# Altium project AC_fan.PrjPcb
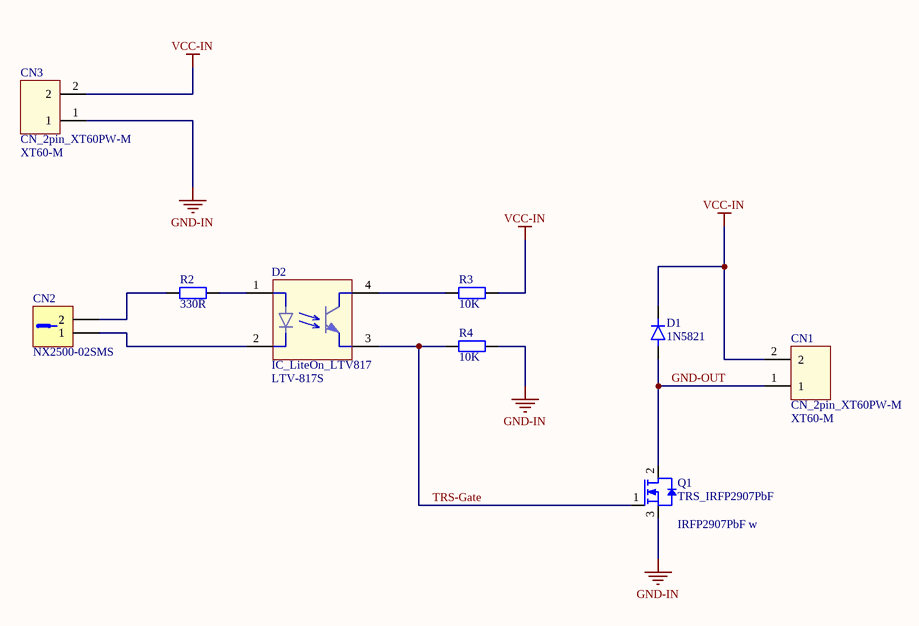
[diagram p0: AC_fan.SchDoc]
1 sheet, 9 parts. Net scope: global (net labels, ports and power ports of the same name join across sheets).
Board file: AC_fan.PcbDoc

## Sheet AC_fan.SchDoc
size A; SheetNumber: 1; SheetTotal: 1

### Parts
CN1  CN_2pin_XT60PW-M  Value1: XT60-M  [CN_2pin_XT60-M]
CN2  Value1: NX2500-02SMS  [CN_XH2.54-2P-MALE]  (hidden comment: CN_1X2M)
CN3  CN_2pin_XT60PW-M  Value1: XT60-M  [CN_2pin_XT60-M]
D1  Value1: 1N5821  [DO-201AD-Horizontal]  (hidden comment: DIO)
D2  IC_LiteOn_LTV817  Value1: LTV-817S  [IC_LiteOn_ LTV-817S]
Q1  TRS_IRFP2907PbF  Value1: IRFP2907PbF / w  [TO-247AC]
R2  Value1: 330R  [RESC2012X60N]  (hidden comment: RES)
R3  Value1: 10K  [RESC2012X60N]  (hidden comment: RES)
R4  Value1: 10K  [RESC2012X60N]  (hidden comment: RES)

### Nets
GND-IN: CN3.1 Q1.3(S) R4.2
VCC-IN: CN1.2 CN3.2 D1.1(K) R3.2
GND-OUT: CN1.1 D1.2(A) Q1.2(D)
TRS-Gate: D2.3 Q1.1(G) R4.1
NetCN2_1: CN2.1 D2.2
NetCN2_2: CN2.2 R2.1
NetD2_1: D2.1 R2.2
NetD2_4: D2.4 R3.1

### Library data of the parts
CN1 CN3 = 02_10140: 30A, 2 pin; Manufacturer: AMASS; AutoId: 182; Value2: 2 pin; DeviceType: Connector_; Id: 02_10140; MountType: SMT; ComponentLink1Description: Datasheet; ComponentLink1URL: X:\01_Datasheets\XT60.pdf; ComponentLink2Description: ComponentVerificationSheet; ComponentLink2URL: X:\02_ComponentVerificationSheets\
CN2 = 02_10135: Manufacturer: Joint Tech; Manufacturer PN: A2501WV-2P; AutoId: 176; Value2: 2 pin; Value3: 2.54mm; DeviceType: Connector_; Id: 02_10135; MountType: SMT; ComponentLink1Description: Datasheet; ComponentLink1URL: X:\01_Datasheets\; ComponentLink2Description: ComponentVerificationSheet; ComponentLink2URL: X:\02_ComponentVerificationSheets\
D1 = 03_00101: Schottky Diodes & Rectifiers 3 Amp 30 Volt; AutoId: 119; Value2: 30Vr 3A; DeviceType: diode; Id: 03_00101; Value3: Schottky; Manufacturer: Diodes; Manufacturer PN: 1N5821; SubType: Schottky; Status: 0 - Unchecked; ComponentLink1Description: Datasheet; ComponentLink1URL: X:\01_Datasheets\1N5820.pdf; ComponentLink2Description: ComponentVerificationSheet; ComponentLink2URL: X:\02_ComponentVerificationSheets\
D2 = 07_00275: Transistor Output Optocouplers Optocoupler Phototrans; Manufacturer: Lite-On; AutoId: 276; Id: 07_00275; Value2: Optocouplers; Value3: Optocouplers; Manufacturer PN: LTV-817S; DeviceType: Optocouple; Status: 0 - Unchecked; MountType: SMT; ComponentLink1Description: Datasheet; ComponentLink1URL: X:\01_Datasheets\IC_Lite_On_LTV-817S.pdf; ComponentLink2Description: ComponentVerificationSheet; ComponentLink2URL: X:\02_ComponentVerificationSheets\; Supplier 1: Mouser; Supplier Part Number 1: 859-LTV-817S
Q1 = 19_00049: N-channel Power MOSFET Si 75V 209A 3-Pin(3+Tab); Manufacturer: International Rectifier; AutoId: 56; Value2: 75V, 209A; DeviceType: transistor; SubType: N MOSFET; Id: 19_00049; Manufacturer PN: IRFP2907; Status: 0 - Unchecked; MountType: SMT; ComponentLink1Description: Datasheet; ComponentLink1URL: X:\01_Datasheets\IRFP2907.pdf; ComponentLink2Description: ComponentVerificationSheet; ComponentLink2URL: X:\02_ComponentVerificationSheets\
R2 = 15_00323: RESISTOR, 0805, 330R, 1%, SMD; Manufacturer: Yageo; Manufacturer PN: RC0805FR-07330R; AutoId: 323; Value2: 0W125; SubType: Metal film; Id: 15_00323; DeviceType: resistor; Status: 2 - Checked and Approved; MountType: SMT; ComponentLink1Description: Datasheet; ComponentLink1URL: X:\01_Datasheets\RES_YAGEO_RC0805FR.pdf; Supplier 1: Farnell; Supplier Part Number 1: 9237429
R3 R4 = 15_00341: RESISTOR, 0805, 10K, 1%, SMD; Manufacturer: Yageo; Manufacturer PN: RC0805FR-0710K; AutoId: 341; Value2: 0W125; SubType: Metal film; Id: 15_00341; DeviceType: resistor; Status: 0 - Unchecked; MountType: SMT; ComponentLink1Description: Datasheet; ComponentLink1URL: X:\01_Datasheets\RES_YAGEO_RC0805FR.pdf; Supplier 1: Farnell